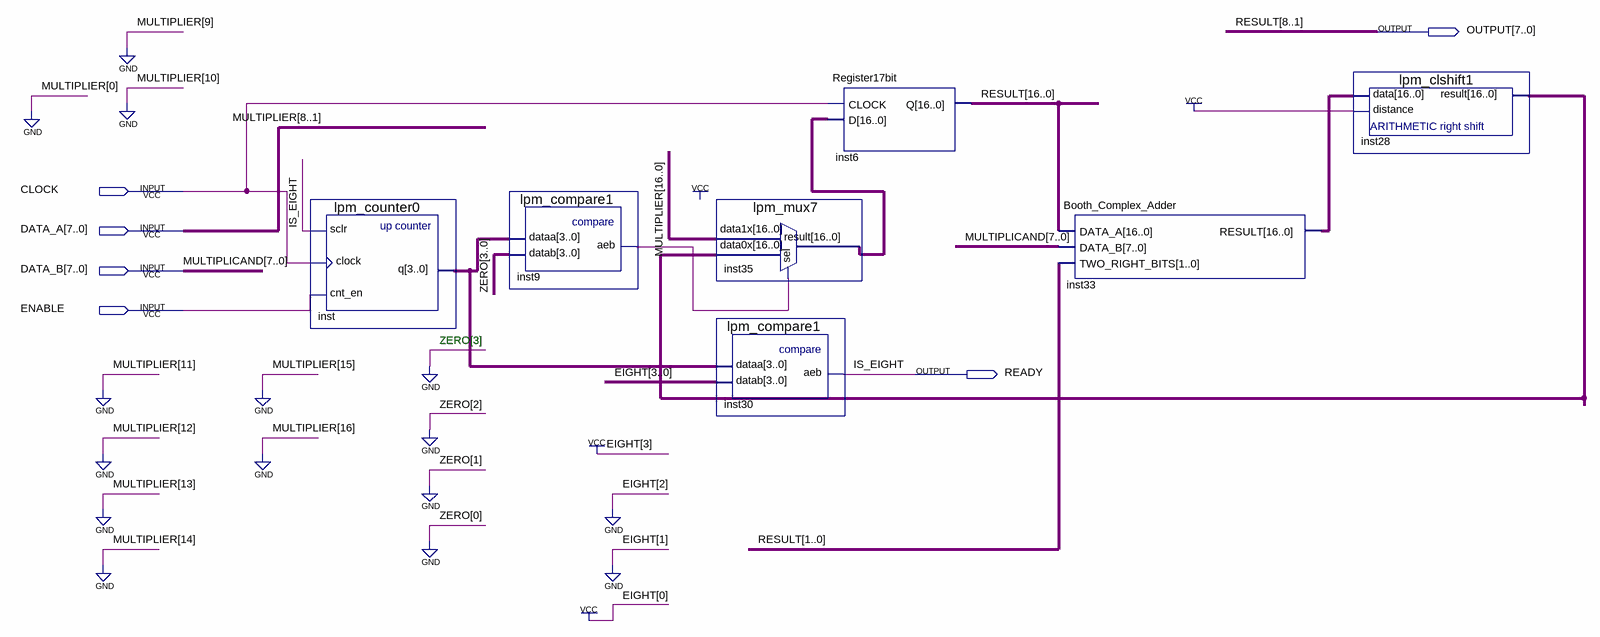
[diagram p0: schematic sheet]
// Quartus schematic Booth_Multiplier.bdf as structural Verilog: 7 symbols, 6 pins
module Booth_Multiplier (
  input  CLOCK,
  input  [7:0] DATA_A,
  input  [7:0] DATA_B,
  input  ENABLE,
  output [7:0] OUTPUT,
  output READY
);

  wire inst9_aeb;
  wire [3:0] inst_q;
  wire [16:0] inst28_result, inst33_result, inst35_result, RESULT;

  lpm_counter0 inst (.sclr(READY), .clock(CLOCK), .cnt_en(ENABLE), .q(inst_q));
  lpm_compare1 inst9 (.dataa(inst_q), .datab(4'b0000), .aeb(inst9_aeb));
  lpm_mux7 inst35 (.data1x({{8{1'b0}}, DATA_A, 1'b0}), .data0x(inst28_result), .sel(inst9_aeb), .result(inst35_result));
  lpm_compare1 inst30 (.dataa(inst_q), .datab(4'b1001), .aeb(READY));
  Register17bit inst6 (.CLOCK(CLOCK), .D(inst35_result), .Q({RESULT[16:9], OUTPUT, RESULT[0]}));
  Booth_Complex_Adder inst33 (
    .DATA_A({RESULT[16:9], OUTPUT, RESULT[0]}), .DATA_B(DATA_B), .TWO_RIGHT_BITS({OUTPUT[0], RESULT[0]}),
    .RESULT(inst33_result));
  lpm_clshift1 inst28 (.data(inst33_result), .distance(1'b1), .result(inst28_result));

  // Other names for the same wires on the sheet: MULTIPLIER[8:1] = DATA_A; IS_EIGHT = READY;
  //   MULTIPLICAND[7:0] = DATA_B; RESULT[8:1] = OUTPUT

  // Notes on the sheet:
  //   ZERO[3]
endmodule
